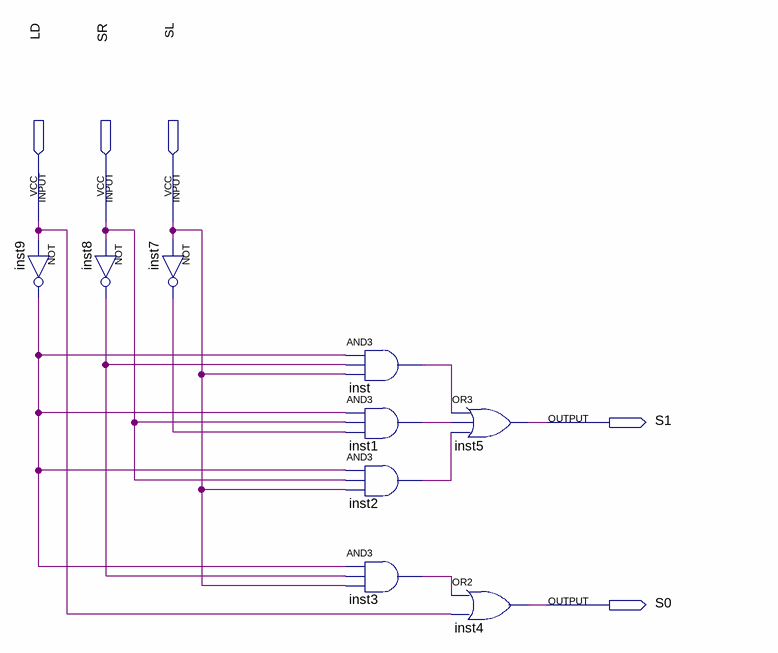
[diagram p0: schematic sheet]
// Quartus schematic ctrl_in.bdf as structural Verilog: 9 symbols, 5 pins
module ctrl_in (
  input  LD,
  input  SR,
  input  SL,
  output S1,
  output S0
);

  wire inst1_out, inst2_out, inst3_out, inst7_out, inst8_out, inst9_out, inst_out;

  not inst8 (inst8_out, SR);
  not inst9 (inst9_out, LD);
  not inst7 (inst7_out, SL);
  and inst (inst_out, inst9_out, inst8_out, SL);
  and inst1 (inst1_out, inst9_out, SR, inst7_out);
  and inst2 (inst2_out, inst9_out, SR, SL);
  and inst3 (inst3_out, inst9_out, inst8_out, SL);
  or inst5 (S1, inst_out, inst1_out, inst2_out);
  or inst4 (S0, inst3_out, LD);
endmodule
